# Altium schematic sheet connector.SchDoc
size A3
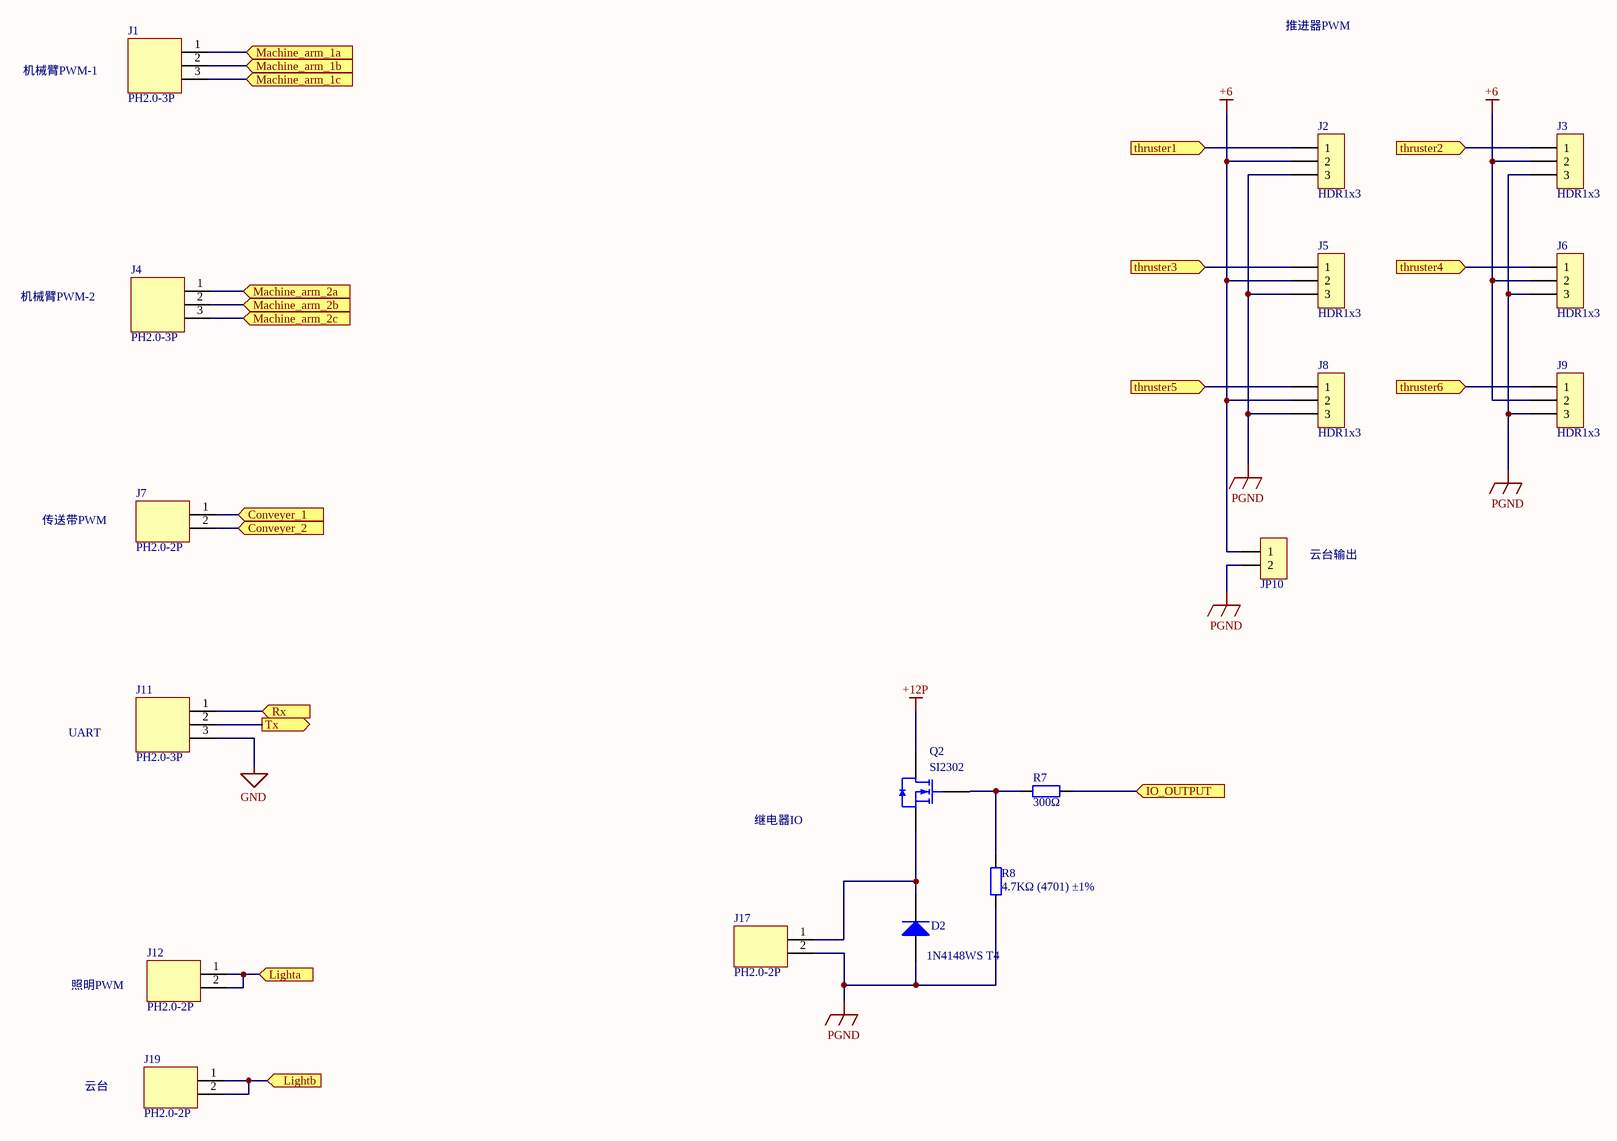
[diagram p0: connector.SchDoc]

## Parts
D2  1N4148WS T4  [SOD-323]
J1  PH2.0-3P  [PH2.0-3P]
J2  HDR1x3  [PIN-3-2.54-1.0]
J3  HDR1x3  [PIN-3-2.54-1.0]
J4  PH2.0-3P  [PH2.0-3P]
J5  HDR1x3  [PIN-3-2.54-1.0]
J6  HDR1x3  [PIN-3-2.54-1.0]
J7  PH2.0-2P  [PH2.0-2P]
J8  HDR1x3  [PIN-3-2.54-1.0]
J9  HDR1x3  [PIN-3-2.54-1.0]
J11  PH2.0-3P  [PH2.0-3P]
J12  PH2.0-2P  [PH2.0-2P]
J17  PH2.0-2P  [PH2.0-2P]
J19  PH2.0-2P  [PH2.0-2P]
JP10  HDR-1X2  [KF128-5.08-2P]  (value not drawn)
Q2  SI2302  [SOT-23(SOT-23-3)]
R7  300Ω  [0603_R]
R8  4.7KΩ (4701) ±1%  [0603_R]

## Ports
Conveyer_1 (in), Conveyer_2 (in), IO_OUTPUT (in), Lighta (in), Lightb (in), Machine_arm_1a (in), Machine_arm_1b (in), Machine_arm_1c (in), Machine_arm_2a (in), Machine_arm_2b (in), Machine_arm_2c (in), Rx (in), thruster1 (in), thruster2 (in), thruster3 (in), thruster4 (in), thruster5 (in), thruster6 (in), Tx (out)

## Nets
+6: J2.2 J3.2 J5.2 J6.2 J8.2 J9.2 JP10.1
+12P: Q2.3(D)
GND: J11.3
PGND: D2.1(A) J2.3 J3.3 J5.3 J6.3 J8.3 J9.3 J17.2 JP10.2 R8.1
Conveyer_1: J7.1 ; port Conveyer_1
Conveyer_2: J7.2 ; port Conveyer_2
IO_OUTPUT: R7.2 ; port IO_OUTPUT
Lighta: J12.1 J12.2 ; port Lighta
Lightb: J19.1 J19.2 ; port Lightb
Machine_arm_1a: J1.1 ; port Machine_arm_1a
Machine_arm_1b: J1.2 ; port Machine_arm_1b
Machine_arm_1c: J1.3 ; port Machine_arm_1c
Machine_arm_2a: J4.1 ; port Machine_arm_2a
Machine_arm_2b: J4.2 ; port Machine_arm_2b
Machine_arm_2c: J4.3 ; port Machine_arm_2c
Rx: J11.1 ; port Rx
thruster1: J2.1 ; port thruster1
thruster2: J3.1 ; port thruster2
thruster3: J5.1 ; port thruster3
thruster4: J6.1 ; port thruster4
thruster5: J8.1 ; port thruster5
thruster6: J9.1 ; port thruster6
Tx: J11.2 ; port Tx
NetD2_2: D2.2(K) J17.1 Q2.2(S)
NetQ2_1: Q2.1(G) R7.1 R8.2

## Notes on the sheet
- 机械臂PWM-1
- 推进器PWM
- 机械臂PWM-2
- 传送带PWM
- (near JP10) 云台输出
- UART
- 继电器IO
- 照明PWM
- 云台

## Library data of the parts
D2 = SOD-323 1N4148WS T4: 二极管; ComponentLink1Description: 供应商链接; ComponentLink1URL: http://www.szlcsc.com/product/details_2485.html; Package: SOD-323; Supplier: LC; SuppliersPartNumber: C2128
J2 J3 J5 J6 J8 J9 = HDR1x3: Connector
JP10 = Header 2: 2P接插件; 版权归属: 源创客; BOM名称: 2P接插件; 学习资源: www.ooocke.com
Q2 = 2N7002 7002: MOS(场效应管); ComponentLink1Description: 供应商链接; ComponentLink1URL: http://www.szlcsc.com/product/details_9040.html; Package: SOT-23(SOT-23-3); Supplier: LC; SuppliersPartNumber: C8545
R7 = 0603 10KΩ (1002) 1%: 贴片电阻; ComponentLink1Description: 供应商链接; ComponentLink1URL: http://www.szlcsc.com/product/details_26547.html; Package: 0603; Supplier: LC; SuppliersPartNumber: C25804
R8 = 0603 4.7KΩ (4701) 1%: 贴片电阻; ComponentLink1Description: 供应商链接; ComponentLink1URL: http://www.szlcsc.com/product/details_23889.html; Package: 0603; Supplier: LC; SuppliersPartNumber: C23162